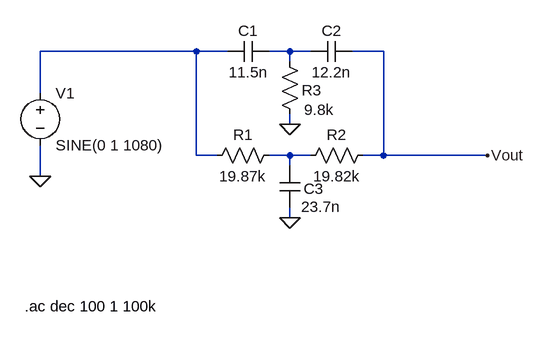
[diagram p0: schematic Twin_T_Filter_Actual_Values.asc]
Twin_T_Filter_Actual_Values.asc, the LTspice schematic file:
Version 4
SHEET 1 1712 1132
WIRE 800 -176 560 -176
WIRE 848 -176 800 -176
WIRE 944 -176 912 -176
WIRE 976 -176 944 -176
WIRE 1088 -176 1040 -176
WIRE 944 -160 944 -176
WIRE 560 -112 560 -176
WIRE 944 -64 944 -80
WIRE 800 -16 800 -176
WIRE 832 -16 800 -16
WIRE 944 -16 912 -16
WIRE 976 -16 944 -16
WIRE 1088 -16 1088 -176
WIRE 1088 -16 1056 -16
WIRE 1248 -16 1088 -16
WIRE 944 0 944 -16
WIRE 560 16 560 -32
WIRE 944 80 944 64
FLAG 1248 -16 Vout
FLAG 560 16 0
FLAG 944 -64 0
FLAG 944 80 0
SYMBOL res 928 -32 R90
WINDOW 0 0 56 VBottom 2
WINDOW 3 32 56 VTop 2
SYMATTR InstName R1
SYMATTR Value 19.87k
SYMBOL res 1072 -32 R90
WINDOW 0 0 56 VBottom 2
WINDOW 3 32 56 VTop 2
SYMATTR InstName R2
SYMATTR Value 19.82k
SYMBOL res 960 -64 R180
WINDOW 0 -33 52 Left 2
WINDOW 3 -52 22 Left 2
SYMATTR InstName R3
SYMATTR Value 9.8k
SYMBOL voltage 560 -128 R0
SYMATTR InstName V1
SYMATTR Value SINE(0 1 1080)
SYMATTR Value2 AC 1
SYMBOL cap 912 -192 R90
WINDOW 0 0 32 VBottom 2
WINDOW 3 32 32 VTop 2
SYMATTR InstName C1
SYMATTR Value 11.5n
SYMATTR SpiceLine mfg="   ---" pn="   ---" type="   ---"
SYMBOL cap 1040 -192 R90
WINDOW 0 0 32 VBottom 2
WINDOW 3 32 32 VTop 2
SYMATTR InstName C2
SYMATTR Value 12.2n
SYMATTR SpiceLine mfg="   ---" pn="   ---" type="   ---"
SYMBOL cap 960 64 R180
WINDOW 0 -36 29 Left 2
WINDOW 3 -62 1 Left 2
SYMATTR InstName C3
SYMATTR Value 23.7n
SYMATTR SpiceLine mfg="   ---" pn="   ---" type="   ---"
TEXT 536 216 Left 2 !.ac dec 100 1 100k

The netlist it stands for:
* Twin_T_Filter_Actual_Values.asc
R1 N003 N001 19.87k
R2 Vout N003 19.82k
R3 0 N002 9.8k
V1 N001 0 SINE(0 1 1080) AC 1
C1 N002 N001 11.5n mfg="   ---" pn="   ---" type="   ---"
C2 Vout N002 12.2n mfg="   ---" pn="   ---" type="   ---"
C3 0 N003 23.7n mfg="   ---" pn="   ---" type="   ---"
.ac dec 100 1 100k
.backanno
.end